# Altium schematic sheet I2C UV Sensor.SchDoc: I2C UV Sensor Socket
size 292 x 193 mm; SheetNumber: 21; SheetTotal: 21
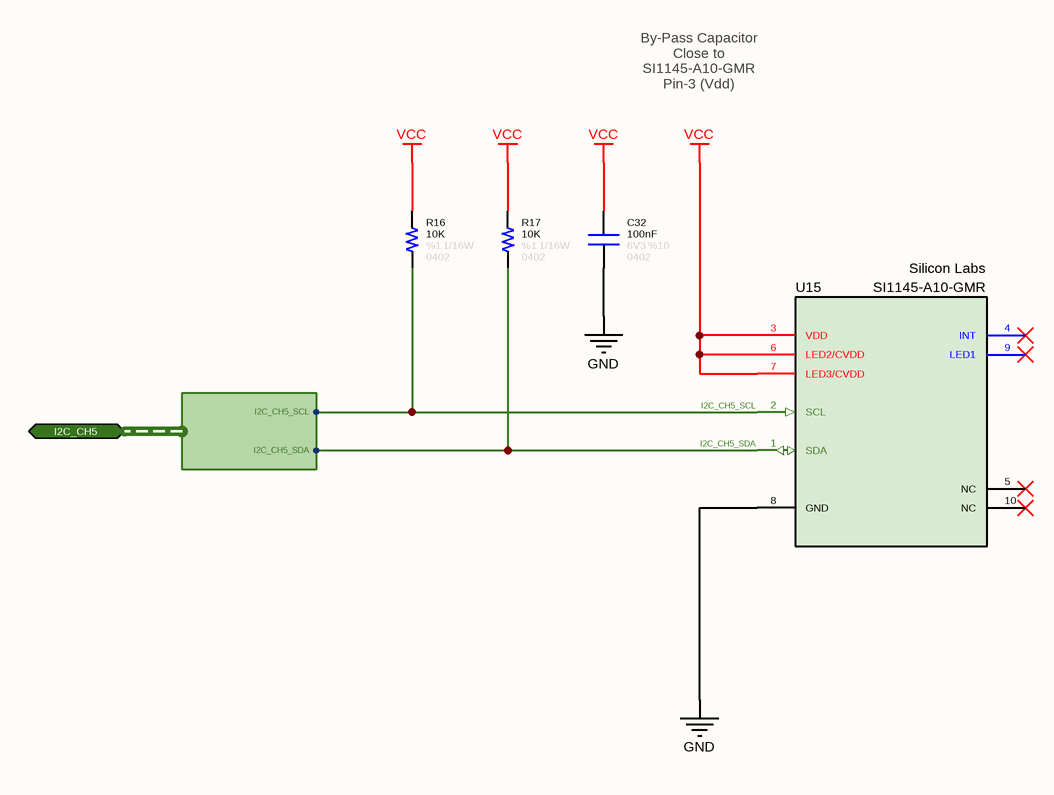
[diagram p0: I2C UV Sensor.SchDoc]

## Parts
C32  value 100nF  Tolerance: %10  Voltage: 6V3  Case: 0402  [CAPACITOR_0402]  (hidden comment: Capacitor - 100nF [0402] (Ceramic))
R16  value 10K  Tolerance: %1  Case: 0402  Power: 1/16W  [RESISTOR_0402]  (hidden comment: 10K - 0402 - %1 - 1/16W)
R17  value 10K  Tolerance: %1  Case: 0402  Power: 1/16W  [RESISTOR_0402]  (hidden comment: 10K - 0402 - %1 - 1/16W)
U15  Manufacturer Name: Silicon Labs  [SI1145]  (hidden comment: Si1145-A10-GMR)

## Ports
I2C_CH5 (bidir, harness I2C_CH5)

## Harnesses
I2C_CH5: I2C_CH5_SCL, I2C_CH5_SDA

## Nets
GND: C32.1 U15.8(GND)
VCC: C32.2 R16.2 R17.2 U15.3(VDD) U15.6(LED2/CVDD) U15.7(LED3/CVDD)
I2C_CH5_SCL: R16.1 U15.2(SCL) ; port I2C_CH5.I2C_CH5_SCL
I2C_CH5_SDA: R17.1 U15.1(SDA) ; port I2C_CH5.I2C_CH5_SDA

Not connected (* = marked no-connect by the designer): U15 4(INT)* 5(NC)* 9(LED1)* 10(NC)*

## Notes on the sheet
- By-Pass Capacitor
  Close to SI1145-A10-GMR
  Pin-3 (Vdd)
- © 2021 All rights reserved.
  This document may not, in whole or in part, be copied, photocopied, reproduced, translated or converted to any electronic or machine readable from without prior written permission of Mehmet Günce Akkoyun.
  Engineer contact : akkoyun@me.com
- Property of
- Engineer :
- Date :
- Size :
- A4
- Time :
- Project :
- Page :
- /
- Customer :
- Product ID :
- Module ID :
- Version :
- File :
- Revision :

## Library data of the parts
C32 = Capacitor - 100nF [0402-6V3]: Capacitor - 100nF [0402-6V3] (Ceramic); Manufacturer Name: AVX; Manufacturer Part Number: 04026D104KAT4A; ComponentLink1Description: Mouser; ComponentLink1URL: https://www.mouser.com.tr/ProductDetail/AVX/04026D104KAT4A?qs=sGAEpiMZZMs0AnBnWHyRQPg4iYkCw7IMED%2F4kpqgf7w%3D; ComponentLink2Description: DataSheet; ComponentLink2URL: https://www.mouser.com.tr/datasheet/2/40/cx5r-776519.pdf
R16 R17 = Resistor - 10K [0402]: Thick Film Resistors - SMD 1/16 W 10 KOhm 1%; Manufacturer Name: Vishay; Manufacturer Part Number: CRCW040210K0FKED; ComponentLink1Description: DataSheet; ComponentLink1URL: https://www.mouser.com.tr/datasheet/2/427/dcrcwe3-1762152.pdf; ComponentLink2Description: Mouser; ComponentLink2URL: https://www.mouser.com.tr/ProductDetail/Vishay-Dale/CRCW040210K0FKED?qs=sGAEpiMZZMu61qfTUdNhG2DpbjADlD3GcalbOv9utCY%3D
U15 = IC - Si1145-A10-GMR: Proximity Sensors I2C UV Index and Proximity/Ambient Light Sensor with 1 LED Driver; Case: QFN-10; RoHS: Yes; Manufacturer Part Number: SI1145-A10-GMR